# Altium schematic sheet Main.SchDoc
size A; SheetNumber: 1; SheetTotal: 5
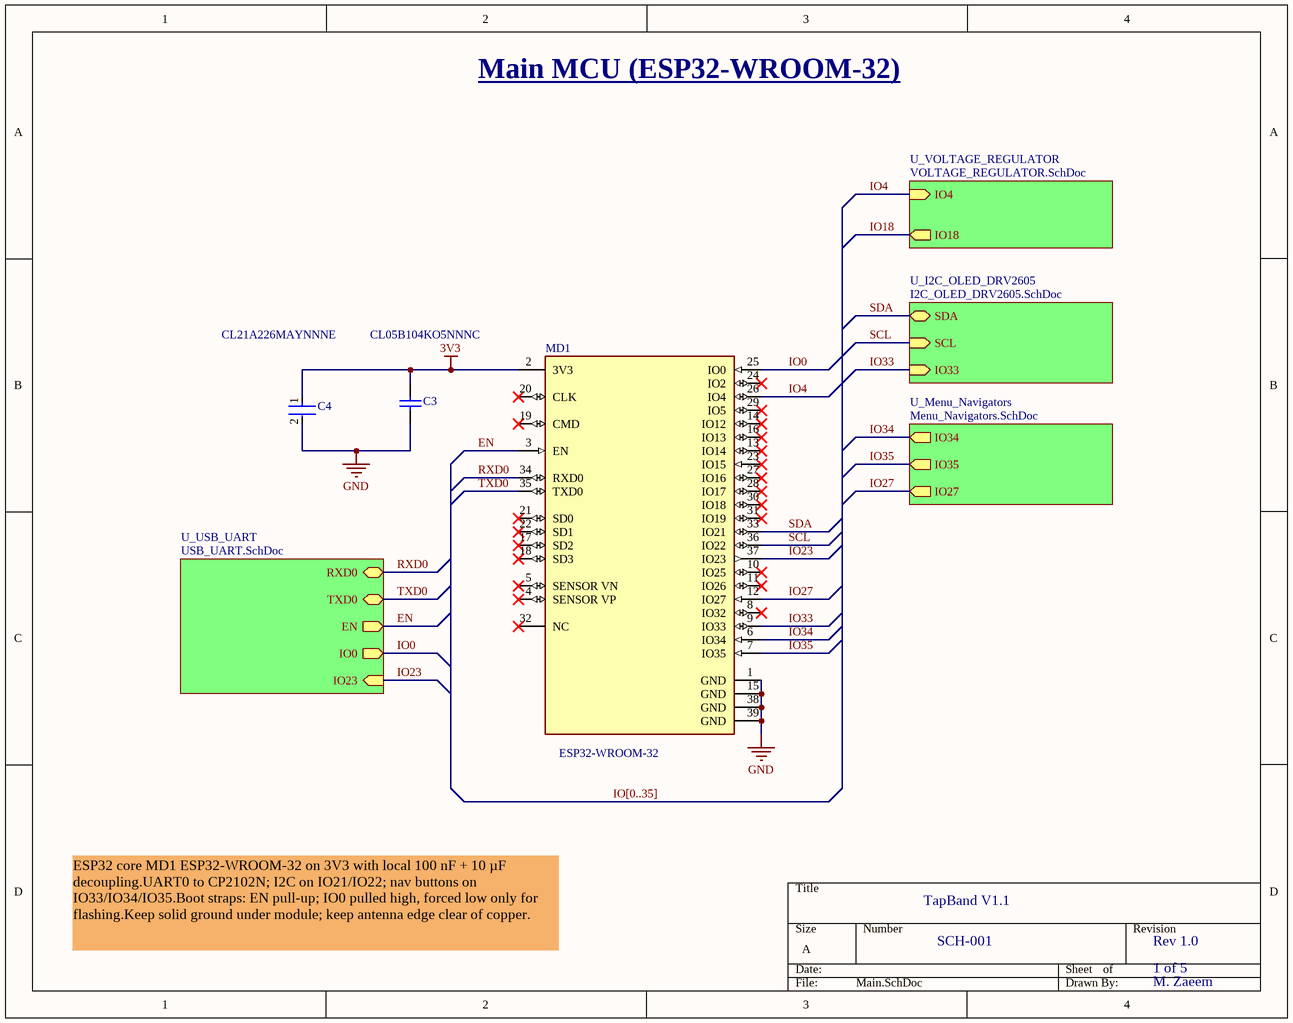
[diagram p0: Main.SchDoc]

## Parts
C3  CL05B104KO5NNNC  [CAPC1050X55X23ML05T13]
C4  CL21A226MAYNNNE  [FP-CL21-IPC_C]
MD1  ESP32-WROOM-32  [FP-ESP32-WROOM-32-MFG]

## Sub-sheets
U_I2C_OLED_DRV2605 = I2C_OLED_DRV2605.SchDoc: SDA (bidir), SCL (in), IO33 (in)
U_Menu_Navigators = Menu_Navigators.SchDoc: IO27 (out), IO34 (out), IO35 (out)
U_USB_UART = USB_UART.SchDoc: IO0 (out), EN (out), IO23 (in), RXD0 (bidir), TXD0 (bidir)
U_VOLTAGE_REGULATOR = VOLTAGE_REGULATOR.SchDoc: IO4 (in), IO18 (out)

## Nets
3V3: C3.2 C4.1 MD1.2(3V3)
GND: C3.1 C4.2 MD1.1(GND) MD1.15(GND) MD1.38(GND) MD1.39(GND)
EN: MD1.3(EN) ; sheet U_USB_UART/EN
IO0: MD1.25(IO0) ; sheet U_USB_UART/IO0
IO4: MD1.26(IO4) ; sheet U_VOLTAGE_REGULATOR/IO4
IO18: sheet U_VOLTAGE_REGULATOR/IO18
IO23: MD1.37(IO23) ; sheet U_USB_UART/IO23
IO27: MD1.12(IO27) ; sheet U_Menu_Navigators/IO27
IO33: MD1.9(IO33) ; sheet U_I2C_OLED_DRV2605/IO33
IO34: MD1.6(IO34) ; sheet U_Menu_Navigators/IO34
IO35: MD1.7(IO35) ; sheet U_Menu_Navigators/IO35
RXD0: MD1.34(RXD0) ; sheet U_USB_UART/RXD0
SCL: MD1.36(IO22) ; sheet U_I2C_OLED_DRV2605/SCL
SDA: MD1.33(IO21) ; sheet U_I2C_OLED_DRV2605/SDA
TXD0: MD1.35(TXD0) ; sheet U_USB_UART/TXD0

Not connected (* = marked no-connect by the designer): MD1 4(SENSOR_VP)* 5(SENSOR_VN)* 8(IO32)* 10(IO25)* 11(IO26)* 13(IO14)* 14(IO12)* 16(IO13)* 17(SD2)* 18(SD3)* 19(CMD)* 20(CLK)* 21(SD0)* 22(SD1)* 23(IO15)* 24(IO2)* 27(IO16)* 28(IO17)* 29(IO5)* 30(IO18)* 31(IO19)* 32(NC)*

## Buses and harness runs
bus IO[0..35]

## Notes on the sheet
- Main MCU (ESP32-WROOM-32)
- TapBand V1.1
- ESP32 core MD1 ESP32‑WROOM‑32 on 3V3 with local 100 nF + 10 µF decoupling.UART0 to CP2102N; I2C on IO21/IO22; nav buttons on IO33/IO34/IO35.Boot straps: EN pull‑up; IO0 pulled high, forced low only for flashing.Keep solid ground under module; keep antenna edge clear of copper.
- SCH-001
- Rev 1.0
- 1 of 5
- M. Zaeem

## Library data of the parts
C3 = CMP-2000-05439-1: Chip Capacitor, 100 nF, +/- 10%, 16 V, -55 to 125 degC, 0402 (1005 Metric), RoHS, Tape and Reel; Manufacturer: Samsung Electro-Mechanics; Capacitance: 100000pF; Dielectric: X7R; Rated Voltage: 16V; Case Size/Dimension: 0402; Tolerance (%): ±10%; Manufacturer URL: http://www.samsungsem.com/global/index.jsp; Datasheet URL: https://datasheet.ciiva.com/29198/458718-da-01-en-vs-kondensator-0402-29198423.pdf; Datasheet Version: Nov-10
C4 = CMP-13271-003225-1: CL21 Series 0805 22uF 25V ±20% Tolerance X5R Multilayer Ceramic Chip Capacitor
MD1 = CMP-194065-000008-1: RX TXRX MOD WIFI SURFACE MOUNT; Frequency: 2.5GHz; Sensitivity: -98dBm; Operating Supply Voltage: 3.6V; Data Rate: 150Mbps; Weight: 0.088185oz; Package Quantity: 550; Min Operating Temperature: -40°C; Mount: Surface Mount; Max Operating Temperature: 85°C; Packaging: Cut Tape; Case/Package: SMD/SMT